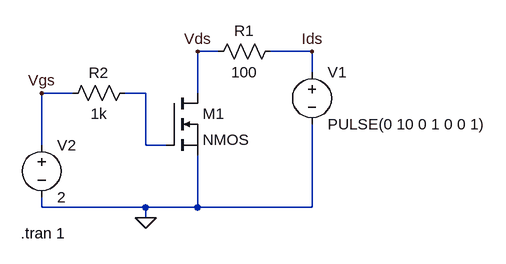
[diagram p0: schematic NMOS ids-vds.asc]
NMOS ids-vds.asc, the LTspice schematic file:
Version 4
SHEET 1 880 680
WIRE 256 48 224 48
WIRE 400 48 336 48
WIRE 400 80 400 48
WIRE 32 112 -16 112
WIRE 144 112 112 112
WIRE 224 112 224 48
WIRE -16 192 -16 112
WIRE 144 192 144 112
WIRE 176 192 144 192
WIRE -16 288 -16 272
WIRE 144 288 -16 288
WIRE 224 288 224 208
WIRE 224 288 144 288
WIRE 400 288 400 160
WIRE 400 288 224 288
WIRE 144 304 144 288
FLAG 144 304 0
FLAG 224 48 Vds
FLAG 400 48 Ids
FLAG -16 112 Vgs
SYMBOL nmos 176 112 R0
SYMATTR InstName M1
SYMBOL voltage 400 64 R0
WINDOW 123 0 0 Left 0
WINDOW 39 0 0 Left 0
SYMATTR InstName V1
SYMATTR Value PULSE(0 10 0 1 0 0 1)
SYMBOL voltage -16 176 R0
WINDOW 123 0 0 Left 0
WINDOW 39 0 0 Left 0
SYMATTR InstName V2
SYMATTR Value 2
SYMBOL res 352 32 R90
WINDOW 0 0 56 VBottom 2
WINDOW 3 32 56 VTop 2
SYMATTR InstName R1
SYMATTR Value 100
SYMBOL res 128 96 R90
WINDOW 0 0 56 VBottom 2
WINDOW 3 32 56 VTop 2
SYMATTR InstName R2
SYMATTR Value 1k
TEXT -48 328 Left 2 !.tran 1

The netlist it stands for:
* NMOS ids-vds.asc
M1 Vds N001 0 0 NMOS
V1 Ids 0 PULSE(0 10 0 1 0 0 1)
V2 Vgs 0 2
R1 Ids Vds 100
R2 N001 Vgs 1k
.model NMOS NMOS
.model PMOS PMOS
.lib standard.mos
.tran 1
.backanno
.end